# Altium project Arduino Core.PrjPcb
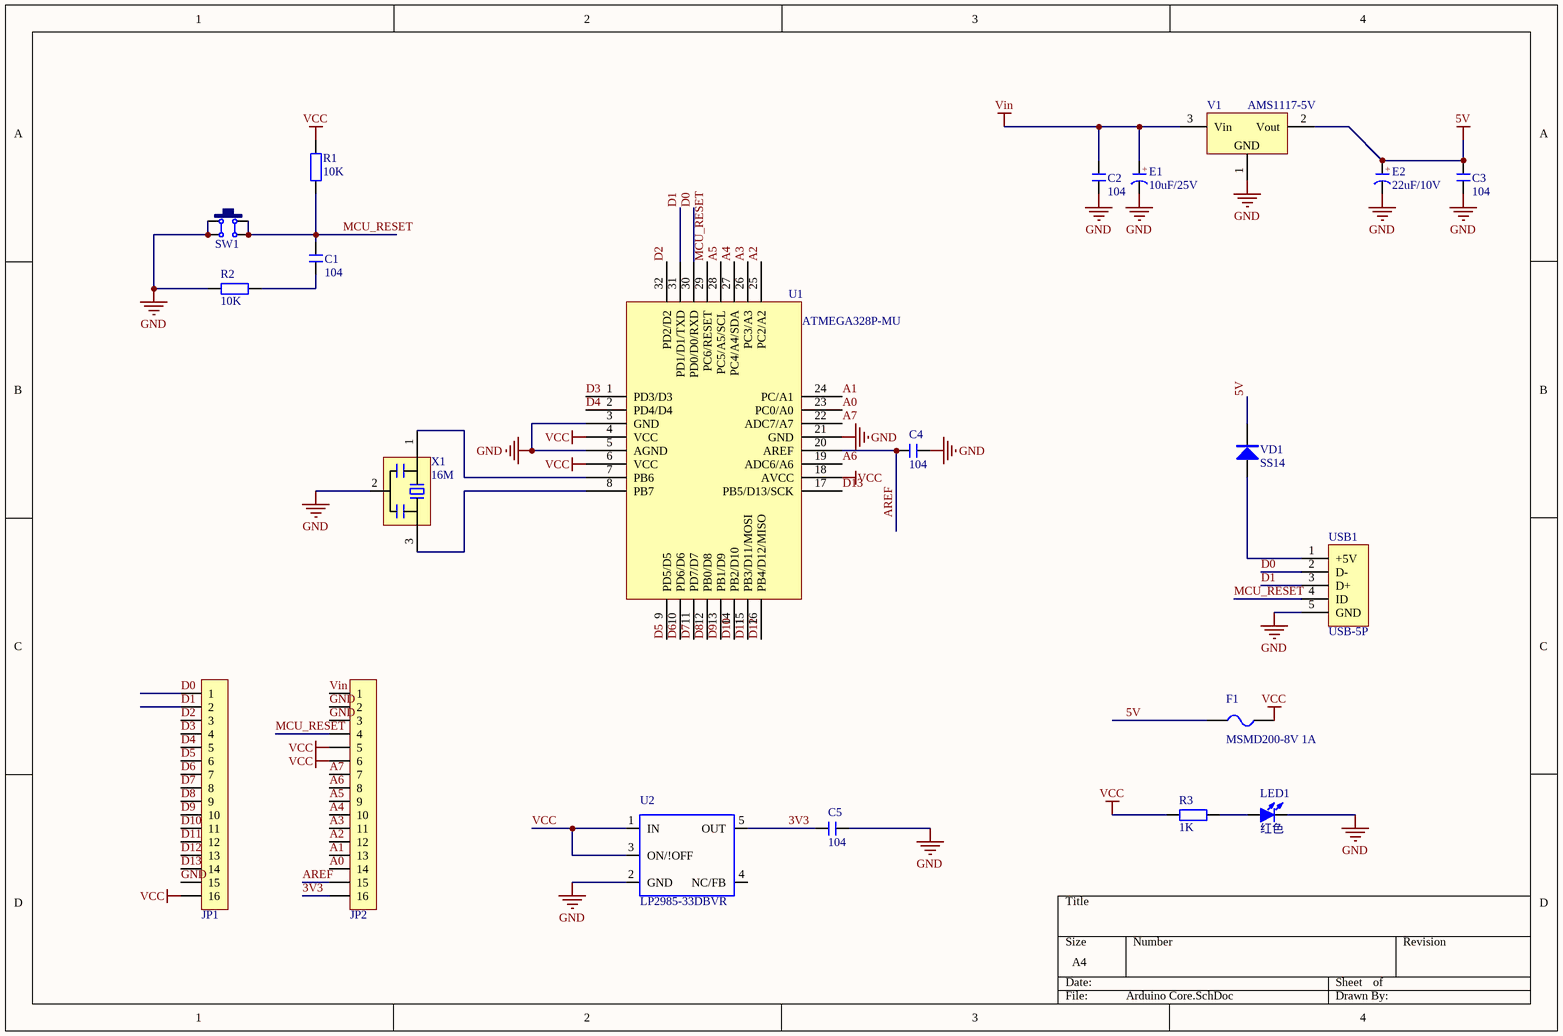
[diagram p0: Arduino Core.SchDoc]
1 sheet, 21 parts. Net scope: global (net labels, ports and power ports of the same name join across sheets).
Board file: Arduino Core.PcbDoc

## Sheet Arduino Core.SchDoc
size A4

### Parts
C1  104  [C 0603]
C2  104  [C 0603]
C3  104  [C 0603]
C4  104  [C 0603]
C5  104  [C 0603]
E1  10uF/25V  [CD A(3216)]
E2  22uF/10V  [CD A(3216)]
F1  MSMD200-8V 1A  [FU 1812]
JP1  HDR-1X16  [HDR-1X16]  (value not drawn)
JP2  HDR-1X16  [HDR-1X16]  (value not drawn)
LED1  红色  [LED 0603B]
R1  10K  [R 0603]
R2  10K  [R 0603]
R3  1K  [R 0603]
SW1  4x4x1.5  [TS4x4x1.5]  (value not drawn)
U1  ATMEGA328P-MU  [LQFP32 7X7_L]
U2  LP2985-33DBVR  [SOT23-5L]
USB1  USB-5P  [USB-MICRO_D]
V1  AMS1117-5V  [SOT223_N]
VD1  SS14  [SMA]
X1  16M  [T-3213]

### Nets
5V: C3.2 E2.1(A) F1.1 V1.2(Vout) VD1.2(K)
GND: C2.1 C3.1 C4.2 C5.2 E1.2(K) E2.2(K) JP1.15 JP2.2 JP2.3 LED1.2(K) R2.1 SW1.1 SW1.4 U1.3(GND) U1.5(AGND) U1.21(GND) U2.2(GND) USB1.5(GND) V1.1(GND) X1.2
VCC: F1.2 JP1.16 JP2.5 JP2.6 R1.1 R3.1 U1.4(VCC) U1.6(VCC) U1.18(AVCC) U2.1(IN) U2.3(ON/!OFF)
Vin: C2.2 E1.1(A) JP2.1 V1.3(Vin)
3V3: C5.1 JP2.16 U2.5(OUT)
A0: JP2.14 U1.23(PC0/A0)
A1: JP2.13 U1.24(PC/A1)
A2: JP2.12 U1.25(PC2/A2)
A3: JP2.11 U1.26(PC3/A3)
A4: JP2.10 U1.27(PC4/A4/SDA)
A5: JP2.9 U1.28(PC5/A5/SCL)
A6: JP2.8 U1.19(ADC6/A6)
A7: JP2.7 U1.22(ADC7/A7)
AREF: C4.1 JP2.15 U1.20(AREF)
D0: JP1.1 U1.30(PD0/D0/RXD) USB1.2(D-)
D1: JP1.2 U1.31(PD1/D1/TXD) USB1.3(D+)
D2: JP1.3 U1.32(PD2/D2)
D3: JP1.4 U1.1(PD3/D3)
D4: JP1.5 U1.2(PD4/D4)
D5: JP1.6 U1.9(PD5/D5)
D6: JP1.7 U1.10(PD6/D6)
D7: JP1.8 U1.11(PD7/D7)
D8: JP1.9 U1.12(PB0/D8)
D9: JP1.10 U1.13(PB1/D9)
D10: JP1.11 U1.14(PB2/D10)
D11: JP1.12 U1.15(PB3/D11/MOSI)
D12: JP1.13 U1.16(PB4/D12/MISO)
D13: JP1.14 U1.17(PB5/D13/SCK)
MCU_RESET: C1.2 JP2.4 R1.2 SW1.2 SW1.3 U1.29(PC6/RESET) USB1.4(ID)
NetC1_1: C1.1 R2.2
NetLED1_1: LED1.1(A) R3.2
NetU1_7: U1.7(PB6) X1.1
NetU1_8: U1.8(PB7) X1.3
NetUSB1_1: USB1.1(+5V) VD1.1(A)

Not connected (* = marked no-connect by the designer): U2 4(NC/FB)

### Notes on the sheet
- (in symbol C-CD) +

### Library data of the parts
C1-C5 = C: 无极性贴片电容; 版权归属: 源创客; BOM名称: 无极性贴片电容; 学习资源: www.ooocke.com
E1 E2 = C-CD: 贴片钽电容; 版权归属: 源创客; BOM名称: 贴片钽电容; 学习资源: www.ooocke.com
F1 = FU: 贴片保险丝; 版权归属: 源创客; BOM名称: 贴片保险丝; 学习资源: www.ooocke.com
JP1 JP2 = Header 16: 16P接插件; 版权归属: 源创客; BOM名称: 16P接插件; 学习资源: www.ooocke.com
LED1 = LED-SMD: 贴片LED; 版权归属: 源创客; BOM名称: 贴片LED; 学习资源: www.ooocke.com
R1-R3 = R: 贴片电阻; 版权归属: 源创客; BOM名称: 贴片电阻; 学习资源: www.ooocke.com
SW1 = TS-030: 防水轻触开关; 版权归属: 源创客; BOM名称: 防水轻触开关; 学习资源: www.ooocke.com
U1 = ATMEGA328P: AVR单片机; 版权归属: 源创客; BOM名称: AVR单片机; 学习资源: www.ooocke.com
U2 = LP2985-XXDBVR33
USB1 = USB-5P: 微型USB母座; 版权归属: 源创客; BOM名称: 微型USB母座; 学习资源: www.ooocke.com
V1 = AMS1117: 三端稳压芯片; BOM名称: 稳压芯片; 版权归属: 源创客; 学习资源: www.ooocke.com
VD1 = SS14: 肖特基二极管; 版权归属: 源创客; 属性: 40V/1A; BOM名称: 肖特基二极管; 学习资源: www.ooocke.com
X1 = XTAL-3: 3脚晶振; BOM名称: 4脚晶振; 版权归属: 源创客; 学习资源: www.ooocke.com